# Altium schematic sheet ETRX_FECU.SchDoc
size A4; DocumentNumber: 1; SheetNumber: 1; SheetTotal: 5
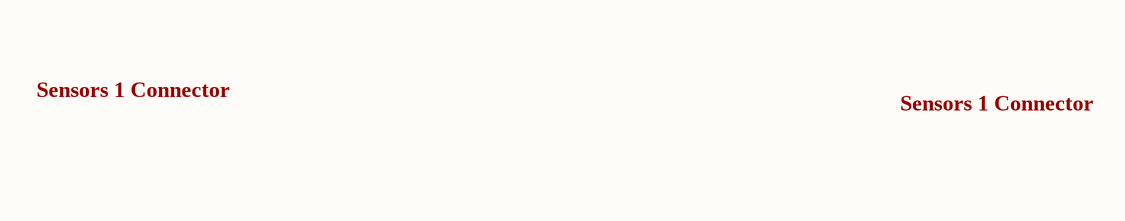
[diagram p0: ETRX_FECU.SchDoc, left]
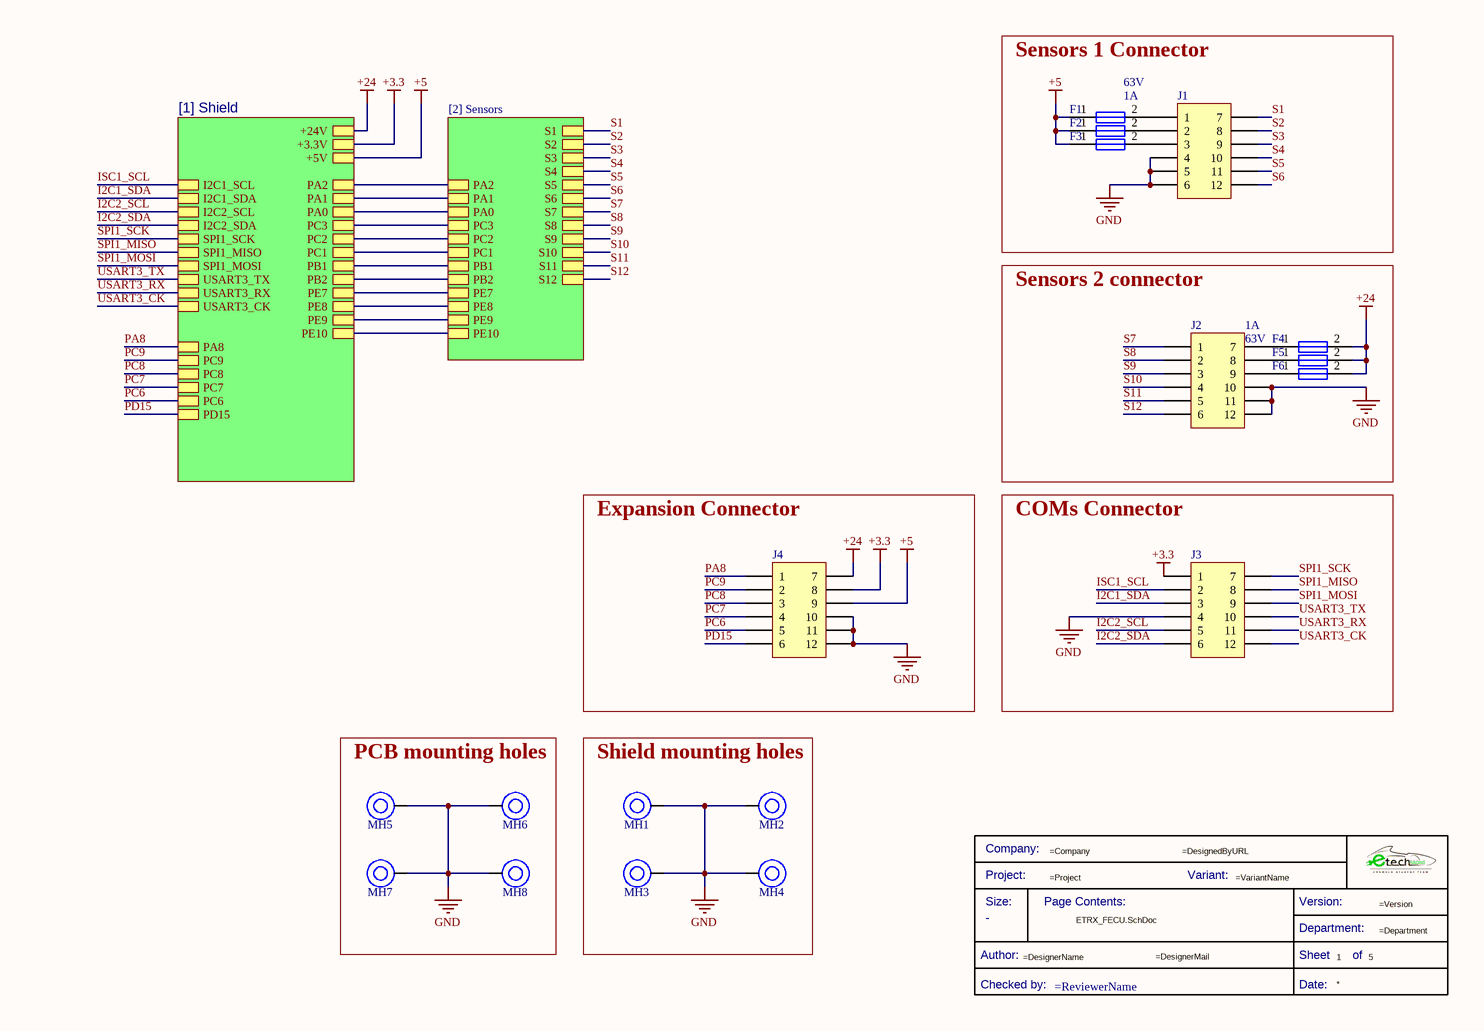
[diagram p1: ETRX_FECU.SchDoc, right]

## Parts
*  Title Block_template  (value not drawn)  (graphical)
F1  Current Rating: 1A  Voltage Rating (DC): 63V  [Fuse_1206]  (hidden comment: 0437001.WRA)
F2  0437001.WRA  [Fuse_1206]  (value not drawn)
F3  0437001.WRA  [Fuse_1206]  (value not drawn)
F4  Current Rating: 1A  Voltage Rating (DC): 63V  [Fuse_1206]  (hidden comment: 0437001.WRA)
F5  0437001.WRA  [Fuse_1206]  (value not drawn)
F6  0437001.WRA  [Fuse_1206]  (value not drawn)
J1  1053101112  [J_NanoFit_2x6_V]  (value not drawn)
J2  1053101112  [J_NanoFit_2x6_V]  (value not drawn)
J3  1053101112  [J_NanoFit_2x6_V]  (value not drawn)
J4  1053101112  [J_NanoFit_2x6_V]  (value not drawn)
MH1  Mounting_Hole_M3  [Mounting_Hole_M3]  (value not drawn)
MH2  Mounting_Hole_M3  [Mounting_Hole_M3]  (value not drawn)
MH3  Mounting_Hole_M3  [Mounting_Hole_M3]  (value not drawn)
MH4  Mounting_Hole_M3  [Mounting_Hole_M3]  (value not drawn)
MH5  Mounting_Hole_M4  [Mounting_Hole_M4]  (value not drawn)
MH6  Mounting_Hole_M4  [Mounting_Hole_M4]  (value not drawn)
MH7  Mounting_Hole_M4  [Mounting_Hole_M4]  (value not drawn)
MH8  Mounting_Hole_M4  [Mounting_Hole_M4]  (value not drawn)

## Blocks framed on the sheet
Sensors 1 Connector: F1-F3 J1
Sensors 2 connector: F4-F6 J2
Expansion Connector: J4
COMs Connector: J3
PCB mounting holes: MH5-MH8
Shield mounting holes: MH1-MH4

## Sub-sheets
[1] Shield = [1] Shield: +24V, +3.3V, +5V, I2C1_SCL, I2C1_SDA, I2C2_SCL, I2C2_SDA, SPI1_SCK, SPI1_MISO, SPI1_MOSI, USART3_TX, USART3_RX, USART3_CK, PA2, PA1, PA0, PC3, PC2, PC1, PB1, PB2, PE7, PE8, PE9, PE10, PA8, PC9, PC8, PC7, PC6, PD15
[2] Sensors = [2] Sensors: PA2, PA1, PA0, PC3, PC2, PC1, PB1, PB2, PE7, PE8, PE9, PE10, S1, S2, S3, S4, S5, S6, S7, S8, S9, S10, S11, S12

## Nets
+3.3: J3.1 J4.8 ; sheet [1] Shield/+3.3V
+5: F1.1 F2.1 F3.1 J4.9 ; sheet [1] Shield/+5V
+24: F4.2 F5.2 F6.2 J4.7 ; sheet [1] Shield/+24V
GND: J1.4 J1.5 J1.6 J2.10 J2.11 J2.12 J3.4 J4.10 J4.11 J4.12 MH1.1 MH2.1 MH3.1 MH4.1 MH5.1 MH6.1 MH7.1 MH8.1
I2C1_SDA: J3.3 ; sheet [1] Shield/I2C1_SDA
I2C2_SCL: J3.5 ; sheet [1] Shield/I2C2_SCL
I2C2_SDA: J3.6 ; sheet [1] Shield/I2C2_SDA
ISC1_SCL: J3.2 ; sheet [1] Shield/I2C1_SCL
PA8: J4.1 ; sheet [1] Shield/PA8
PC6: J4.5 ; sheet [1] Shield/PC6
PC7: J4.4 ; sheet [1] Shield/PC7
PC8: J4.3 ; sheet [1] Shield/PC8
PC9: J4.2 ; sheet [1] Shield/PC9
PD15: J4.6 ; sheet [1] Shield/PD15
S1: J1.7 ; sheet [2] Sensors/S1
S2: J1.8 ; sheet [2] Sensors/S2
S3: J1.9 ; sheet [2] Sensors/S3
S4: J1.10 ; sheet [2] Sensors/S4
S5: J1.11 ; sheet [2] Sensors/S5
S6: J1.12 ; sheet [2] Sensors/S6
S7: J2.1 ; sheet [2] Sensors/S7
S8: J2.2 ; sheet [2] Sensors/S8
S9: J2.3 ; sheet [2] Sensors/S9
S10: J2.4 ; sheet [2] Sensors/S10
S11: J2.5 ; sheet [2] Sensors/S11
S12: J2.6 ; sheet [2] Sensors/S12
SPI1_MISO: J3.8 ; sheet [1] Shield/SPI1_MISO
SPI1_MOSI: J3.9 ; sheet [1] Shield/SPI1_MOSI
SPI1_SCK: J3.7 ; sheet [1] Shield/SPI1_SCK
USART3_CK: J3.12 ; sheet [1] Shield/USART3_CK
USART3_RX: J3.11 ; sheet [1] Shield/USART3_RX
USART3_TX: J3.10 ; sheet [1] Shield/USART3_TX
NetF1_2: F1.2 J1.1
NetF2_2: F2.2 J1.2
NetF3_2: F3.2 J1.3
NetF4_1: F4.1 J2.7
NetF5_1: F5.1 J2.8
NetF6_1: F6.1 J2.9
(unnamed): sheet [1] Shield/PA2, sheet [2] Sensors/PA2
(unnamed): sheet [1] Shield/PA1, sheet [2] Sensors/PA1
(unnamed): sheet [1] Shield/PA0, sheet [2] Sensors/PA0
(unnamed): sheet [1] Shield/PC3, sheet [2] Sensors/PC3
(unnamed): sheet [1] Shield/PC2, sheet [2] Sensors/PC2
(unnamed): sheet [1] Shield/PC1, sheet [2] Sensors/PC1
(unnamed): sheet [1] Shield/PB1, sheet [2] Sensors/PB1
(unnamed): sheet [1] Shield/PB2, sheet [2] Sensors/PB2
(unnamed): sheet [1] Shield/PE7, sheet [2] Sensors/PE7
(unnamed): sheet [1] Shield/PE8, sheet [2] Sensors/PE8
(unnamed): sheet [1] Shield/PE9, sheet [2] Sensors/PE9
(unnamed): sheet [1] Shield/PE10, sheet [2] Sensors/PE10

## Notes on the sheet
- Sensors 1 Connector
- (in symbol Title Block_template) Company:; Project:; Variant:; Size:; Page Contents:; Version:; Department:; Author:; Sheet; of; Checked by:; Date:

## Library data of the parts
* = Title Block_template: Standard Title Block; .Creator: GP; Category: Title Block; .PCBcheck: GP; .SCHcheck: GP; Checked by:: =ReviewerName; Size: -
F1-F6 = Fuse_1A_63V_1206: Fuse Chip Fast Acting 1A 63V SMD Solder Pad 1206 Ceramic T/R Automotive; Manufacturer: Littelfuse; Fuse Type: Board Mount (Cartridge Style Excluded); Approvals: CSA,cURus; .Creator: DO; Supplier 1: Digi-Key; Manufacturer Part Number: 0437001.WRA; RoHS: Yes; Category: Fuses; Stock 1: 5820; Pricing 1: 1=1,52000, 5=1,47000, 10=1,37600, 50=1,13860, 100=0,94880, 250=0,92508, 500=0,78276, 1000=0,68788 (USD); Mount: Surface Mount; Case/Package: 1206; Case Code (Imperial): 1206; Case Code (Metric): 3216; Min Operating Temperature: -55°C; Max Operating Temperature: 150°C; Packaging: Tape and Reel; Voltage Rating (AC): 63V; ComponentLink1URL: https://www.littelfuse.com/~/media/electronics/datasheets/fuses/littelfuse_fuse_437a_datasheet.pdf.pdf?src-supplier=Digi-Key; ComponentLink1Description: https://www.littelfuse.com/~/media/electronics/datasheets/fuses/littelfuse_fuse_437a_datasheet.pdf.pdf?src-supplier=Digi-Key; Supplier Part Number 1: F10001CT-ND; ComponentLink2Description: Where buy it; ComponentLink2URL: https://www.mouser.es/ProductDetail/Littelfuse/0437001WRA?qs=DXv0QSHKF4z9CJhPXjxR%252BA%3D%3D
  F2 F3 F5 F6: Current Rating: 1A; Voltage Rating (DC): 63V
J1-J4 = J_NanoFit_2x6_V: Nano-Fit Vertical Header, Through Hole, 2.50mm Pitch, Dual Row, 12 Circuits, with Kinked Pins, Tin (Sn) Plating, Black, Glow-Wire Capable, Tray